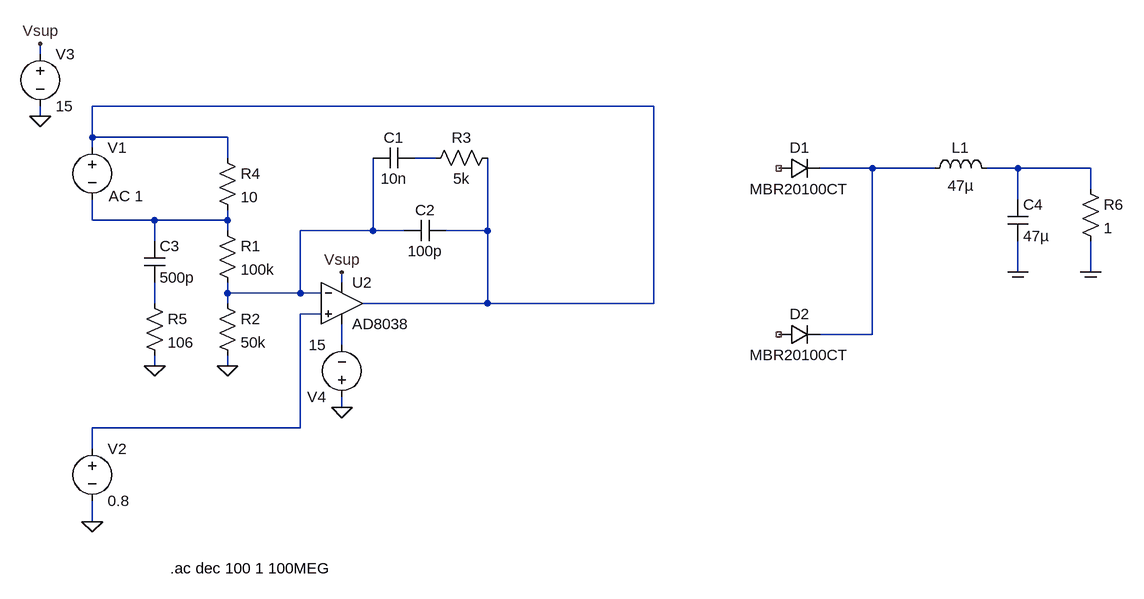
[diagram p0: schematic Full_Bridge_Sandbox.asc]
Full_Bridge_Sandbox.asc, the LTspice schematic file:
Version 4.1
SHEET 1 2008 800
WIRE -128 -224 -128 -240
WIRE 816 -144 -48 -144
WIRE -128 -128 -128 -144
WIRE -48 -96 -48 -144
WIRE 160 -96 -48 -96
WIRE -48 -80 -48 -96
WIRE 160 -64 160 -96
WIRE 480 -64 448 -64
WIRE 1152 -48 1072 -48
WIRE 1248 -48 1152 -48
WIRE 1376 -48 1328 -48
WIRE 1488 -48 1376 -48
WIRE 1488 -16 1488 -48
WIRE 1376 0 1376 -48
WIRE -48 32 -48 0
WIRE 48 32 -48 32
WIRE 160 32 160 16
WIRE 160 32 48 32
WIRE 160 48 160 32
WIRE 384 48 384 -64
WIRE 384 48 272 48
WIRE 432 48 384 48
WIRE 560 48 560 -64
WIRE 560 48 496 48
WIRE 48 64 48 32
WIRE 1376 112 1376 64
WIRE 1488 112 1488 64
WIRE 336 128 336 112
WIRE 160 144 160 128
WIRE 272 144 272 48
WIRE 272 144 160 144
WIRE 304 144 272 144
WIRE 48 160 48 128
WIRE 160 160 160 144
WIRE 560 160 560 48
WIRE 560 160 368 160
WIRE 816 160 816 -144
WIRE 816 160 560 160
WIRE 304 176 272 176
WIRE 1152 208 1152 -48
WIRE 1152 208 1072 208
WIRE 336 224 336 192
WIRE 48 256 48 240
WIRE 160 256 160 240
WIRE 336 320 336 304
WIRE 272 352 272 176
WIRE 272 352 -48 352
WIRE -48 384 -48 352
WIRE -48 496 -48 464
FLAG 160 256 0
FLAG -48 496 0
FLAG 336 112 Vsup
FLAG -128 -240 Vsup
FLAG -128 -128 0
FLAG 48 256 0
FLAG 336 320 0
FLAG 1376 112 COM
FLAG 1488 112 COM
SYMBOL voltage -48 -96 R0
WINDOW 123 25 91 Left 2
WINDOW 39 0 0 Left 0
SYMATTR InstName V1
SYMATTR Value ""
SYMATTR Value2 AC 1
SYMBOL res 144 32 R0
SYMATTR InstName R1
SYMATTR Value 100k
SYMBOL res 144 144 R0
SYMATTR InstName R2
SYMATTR Value 50k
SYMBOL cap 448 -80 R90
WINDOW 0 0 32 VBottom 2
WINDOW 3 32 32 VTop 2
SYMATTR InstName C1
SYMATTR Value 10n
SYMBOL cap 496 32 R90
WINDOW 0 0 32 VBottom 2
WINDOW 3 32 32 VTop 2
SYMATTR InstName C2
SYMATTR Value 100p
SYMBOL res 576 -80 R90
WINDOW 0 0 56 VBottom 2
WINDOW 3 32 56 VTop 2
SYMATTR InstName R3
SYMATTR Value 5k
SYMBOL voltage -48 368 R0
WINDOW 123 0 0 Left 0
WINDOW 39 0 0 Left 0
SYMATTR InstName V2
SYMATTR Value 0.8
SYMBOL voltage -128 -240 R0
WINDOW 123 0 0 Left 0
WINDOW 39 0 0 Left 0
SYMATTR InstName V3
SYMATTR Value 15
SYMBOL res 144 -80 R0
SYMATTR InstName R4
SYMATTR Value 10
SYMBOL OpAmps\\AD8038 336 96 R0
SYMATTR InstName U2
SYMBOL cap 32 64 R0
SYMATTR InstName C3
SYMATTR Value 500p
SYMBOL res 32 144 R0
SYMATTR InstName R5
SYMATTR Value 106
SYMBOL voltage 336 320 R180
WINDOW 123 0 0 Left 0
WINDOW 39 0 0 Left 0
SYMATTR InstName V4
SYMATTR Value 15
SYMBOL ind 1232 -32 R270
WINDOW 0 32 56 VTop 2
WINDOW 3 5 56 VBottom 2
SYMATTR InstName L1
SYMATTR Value 47µ
SYMBOL cap 1360 0 R0
SYMATTR InstName C4
SYMATTR Value 47µ
SYMBOL res 1472 -32 R0
SYMATTR InstName R6
SYMATTR Value 1
SYMBOL diode 1008 -32 R270
WINDOW 0 32 32 VTop 2
WINDOW 3 0 32 VBottom 2
SYMATTR InstName D1
SYMATTR Value MBR20100CT
SYMATTR Description Diode
SYMATTR Type diode
SYMBOL diode 1008 224 R270
WINDOW 0 32 32 VTop 2
WINDOW 3 0 32 VBottom 2
SYMATTR InstName D2
SYMATTR Value MBR20100CT
SYMATTR Description Diode
SYMATTR Type diode
TEXT 72 568 Left 2 !.ac dec 100 1 100MEG

The netlist it stands for:
* Full_Bridge_Sandbox.asc
V1 N001 N005 AC 1
R1 N005 N006 100k
R2 N006 0 50k
C1 N002 N006 10n
C2 N001 N006 100p
R3 N001 N002 5k
V2 N008 0 0.8
V3 Vsup 0 15
R4 N001 N005 10
X§U2 N008 N006 Vsup N009 N001 AD8038  ; pins In+ In- V+ V- OUT
C3 N005 N007 500p
R5 N007 0 106
V4 0 N009 15
L1 N003 N004 47µ
C4 N004 COM 47µ
R6 N004 COM 1
D1 NC_01 N003 MBR20100CT
D2 NC_02 N003 MBR20100CT
.model D D
.lib standard.dio
.ac dec 100 1 100MEG
.backanno
.end